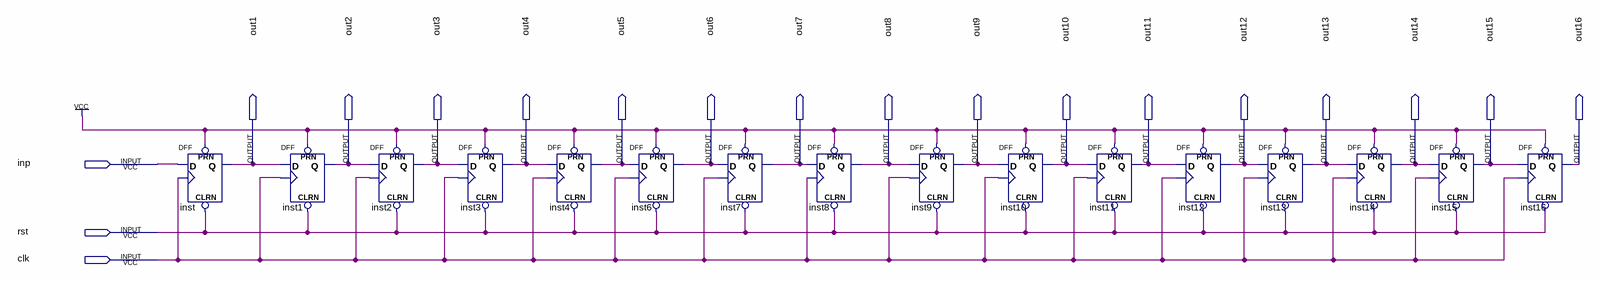
[diagram p0: schematic sheet]
// Quartus schematic ShiftRegisterSIPO_16bit.bdf as structural Verilog: 16 symbols, 19 pins
module ShiftRegisterSIPO_16bit (
  input  inp,
  input  rst,
  input  clk,
  output out1,
  output out2,
  output out3,
  output out4,
  output out5,
  output out6,
  output out7,
  output out8,
  output out9,
  output out10,
  output out11,
  output out12,
  output out13,
  output out14,
  output out15,
  output out16
);

  DFF inst (.CLRN(rst), .CLK(clk), .D(inp), .PRN(1'b1), .Q(out1));
  DFF inst1 (.CLRN(rst), .CLK(clk), .D(out1), .PRN(1'b1), .Q(out2));
  DFF inst2 (.CLRN(rst), .CLK(clk), .D(out2), .PRN(1'b1), .Q(out3));
  DFF inst3 (.CLRN(rst), .CLK(clk), .D(out3), .PRN(1'b1), .Q(out4));
  DFF inst4 (.CLRN(rst), .CLK(clk), .D(out4), .PRN(1'b1), .Q(out5));
  DFF inst6 (.CLRN(rst), .CLK(clk), .D(out5), .PRN(1'b1), .Q(out6));
  DFF inst7 (.CLRN(rst), .CLK(clk), .D(out6), .PRN(1'b1), .Q(out7));
  DFF inst8 (.CLRN(rst), .CLK(clk), .D(out7), .PRN(1'b1), .Q(out8));
  DFF inst9 (.CLRN(rst), .CLK(clk), .D(out8), .PRN(1'b1), .Q(out9));
  DFF inst10 (.CLRN(rst), .CLK(clk), .D(out9), .PRN(1'b1), .Q(out10));
  DFF inst11 (.CLRN(rst), .CLK(clk), .D(out10), .PRN(1'b1), .Q(out11));
  DFF inst12 (.CLRN(rst), .CLK(clk), .D(out11), .PRN(1'b1), .Q(out12));
  DFF inst13 (.CLRN(rst), .CLK(clk), .D(out12), .PRN(1'b1), .Q(out13));
  DFF inst14 (.CLRN(rst), .CLK(clk), .D(out13), .PRN(1'b1), .Q(out14));
  DFF inst15 (.CLRN(rst), .CLK(clk), .D(out14), .PRN(1'b1), .Q(out15));
  DFF inst16 (.CLRN(rst), .CLK(clk), .D(out15), .PRN(1'b1), .Q(out16));
endmodule
